# EAGLE design leiterplatte_kuechenlicht (EAGLE 6.4)
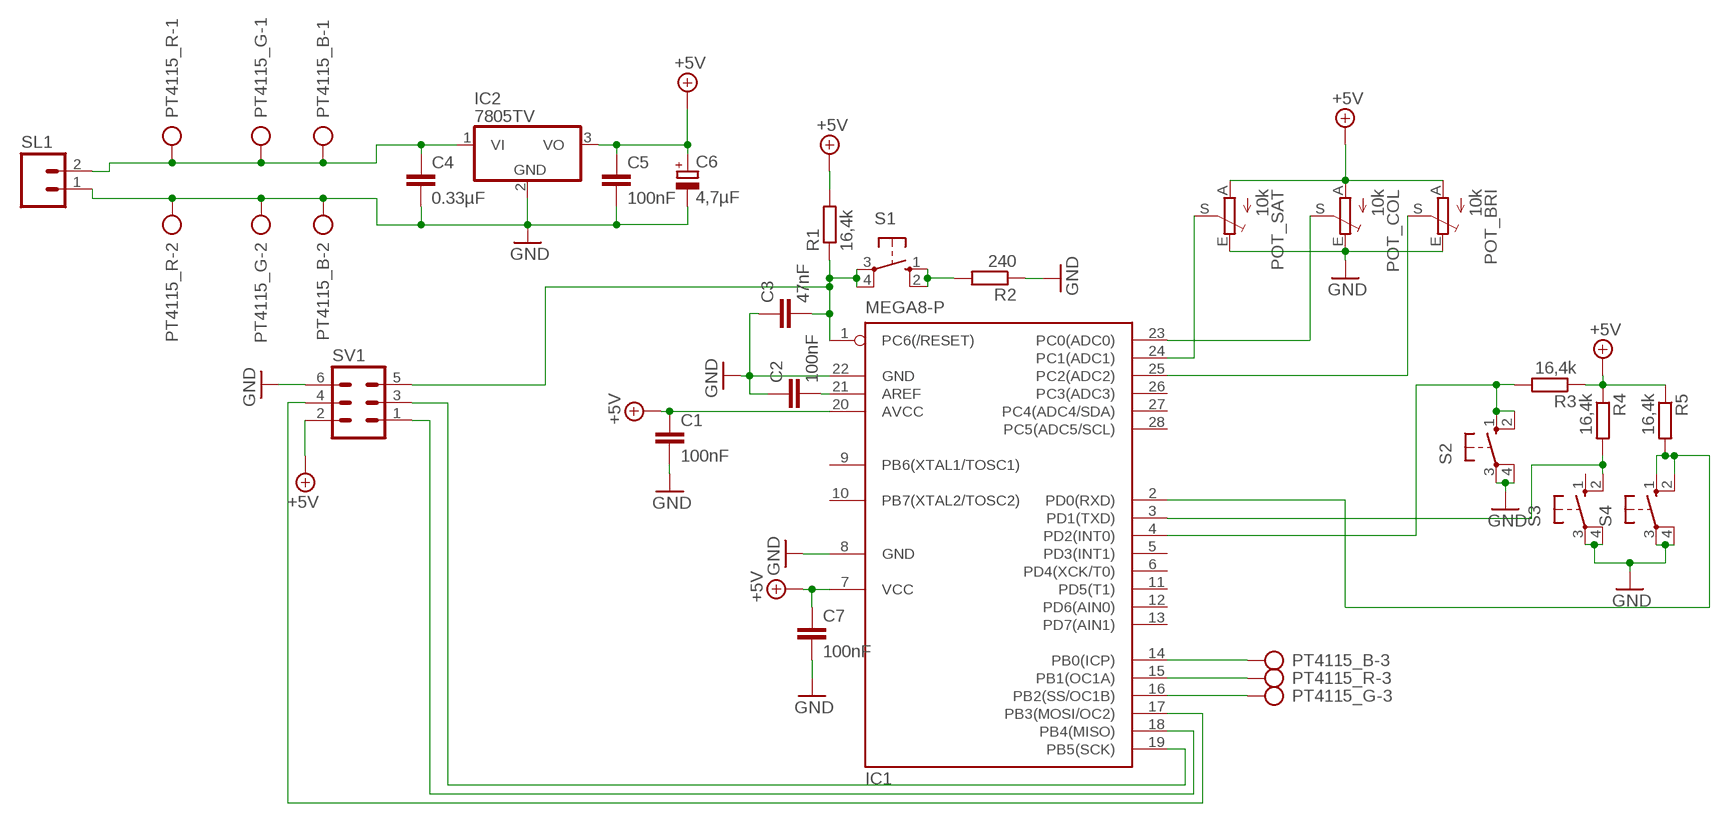
[diagram p0: schematic, sheet 1]

## Parts
C1  100nF  C2,5-3  [C2.5-3]
C2  100nF  C2,5-3  [C2.5-3]
C3  47nF  C-EU050-025X075  [C050-025X075]
C4  0.33µF  C2,5-3  [C2.5-3]
C5  100nF  C2,5-3  [C2.5-3]
C6  4,7µF  CPOL-EUE2,5-6E  [E2,5-6E]
C7  100nF  C2,5-3  [C2.5-3]
IC1  MEGA8-P  [DIL28-3]
IC2  7805TV  [TO220V]
POT_BRI  10k  TRIM_EU-CIP20C-6MM  [CIP20C-6MM]
POT_COL  10k  TRIM_EU-CIP20C-6MM  [CIP20C-6MM]
POT_SAT  10k  TRIM_EU-CIP20C-6MM  [CIP20C-6MM]
PT4115_B  AK300/3  [AK300/3]
PT4115_G  AK300/3  [AK300/3]
PT4115_R  AK300/3  [AK300/3]
R1  16,4k  R-EU_0204/7  [0204/7]
R2  240  R-EU_0204/7  [0204/7]
R3  16,4k  R-EU_0204/7  [0204/7]
R4  16,4k  R-EU_0204/7  [0204/7]
R5  16,4k  R-EU_0204/7  [0204/7]
S1  10-XX  [B3F-10XX]
S2  10-XX  [B3F-10XX]
S3  10-XX  [B3F-10XX]
S4  10-XX  [B3F-10XX]
SL1  M02  [02P]
SV1  ML6  [ML6]

## Nets
+5V: C1.1 C5.1 C6.+ C7.1 IC1.7(VCC) IC1.20(AVCC) IC2.3(VO) POT_BRI.A POT_COL.A POT_SAT.A R1.2 R3.1 R4.1 R5.1 SV1.2
GND: C1.2 C2.1 C3.1 C4.2 C5.2 C6.- C7.2 IC1.8(GND) IC1.22(GND) IC2.2(GND) POT_BRI.E POT_COL.E POT_SAT.E PT4115_B.2 PT4115_G.2 PT4115_R.2 R2.1 S2.3(P) S2.4(P1) S3.3(P) S3.4(P1) S4.3(P) S4.4(P1) SL1.1 SV1.6
N$1: R2.2 S1.1(S) S1.2(S1)
N$2: C4.1 IC2.1(VI) PT4115_B.1 PT4115_G.1 PT4115_R.1 SL1.2
N$3: C2.2 IC1.21(AREF)
N$4: IC1.24(PC1(ADC1)) POT_SAT.S
N$5: IC1.23(PC0(ADC0)) POT_COL.S
N$6: IC1.25(PC2(ADC2)) POT_BRI.S
N$7: IC1.15(PB1(OC1A)) PT4115_R.3
N$8: C3.2 IC1.1(PC6(/RESET)) R1.1 S1.3(P) S1.4(P1) SV1.5
N$9: IC1.19(PB5(SCK)) SV1.3
N$10: IC1.18(PB4(MISO)) SV1.1
N$11: IC1.17(PB3(MOSI/OC2)) SV1.4
N$12: IC1.16(PB2(SS/OC1B)) PT4115_G.3
N$13: IC1.14(PB0(ICP)) PT4115_B.3
N$14: IC1.2(PD0(RXD)) R5.2 S4.1(S) S4.2(S1)
N$15: IC1.3(PD1(TXD)) R4.2 S3.2(S1)
N$19: IC1.4(PD2(INT0)) R3.2 S2.1(S) S2.2(S1)
Unconnected: IC1.5(PD3(INT1)) IC1.6(PD4(XCK/T0)) IC1.9(PB6(XTAL1/TOSC1)) IC1.10(PB7(XTAL2/TOSC2)) IC1.11(PD5(T1)) IC1.12(PD6(AIN0)) IC1.13(PD7(AIN1)) IC1.26(PC3(ADC3)) IC1.27(PC4(ADC4/SDA)) IC1.28(PC5(ADC5/SCL)) S3.1(S)

## Library data of the parts
C1 C2 C4 C5 C7 = capacitor-wima:C: CAPACITOR naming: grid - package width
C3 = rcl:C-EU: CAPACITOR, European symbol
C6 = rcl:CPOL-EU: POLARIZED CAPACITOR, European symbol
IC1 = atmel:MEGA8-P: MICROCONTROLLER 8 Kbytes FLASH, 1 kbytes SRAM, 512 bytes EEPROM, USART, 4-channel 10 bit ADC, 2-channel 8 bit ADC Pin compatible with Atmega48, ATMega88, ATMega168 Source: avr.lbr; OC_FARNELL: unknown; OC_NEWARK: unknown
IC2 = linear:78*: Positive VOLTAGE REGULATOR Source: http://cache.national.com/ds/LM/LM78L05.pdf http://www.fairchildsemi.com/ds/LM/LM7805.pdf
POT_BRI POT_COL POT_SAT = pot:TRIM_EU-: POTENTIOMETER
PT4115_B PT4115_G PT4115_R = con-ptr500:AK300/3: CONNECTOR; OC_FARNELL: unknown; OC_NEWARK: unknown
R1-R5 = rcl:R-EU_: RESISTOR, European symbol
S1-S4 = switch-omron:10-XX: OMRON SWITCH; MPN: B3F-1000; OC_FARNELL: 176432; OC_NEWARK: 36M3542
SL1 = con-amp-quick:M02: AMP QUICK CONNECTOR; OC_FARNELL: unknown; OC_NEWARK: unknown
SV1 = con-ml:ML6: HARTING; OC_FARNELL: unknown; OC_NEWARK: unknown

## Board
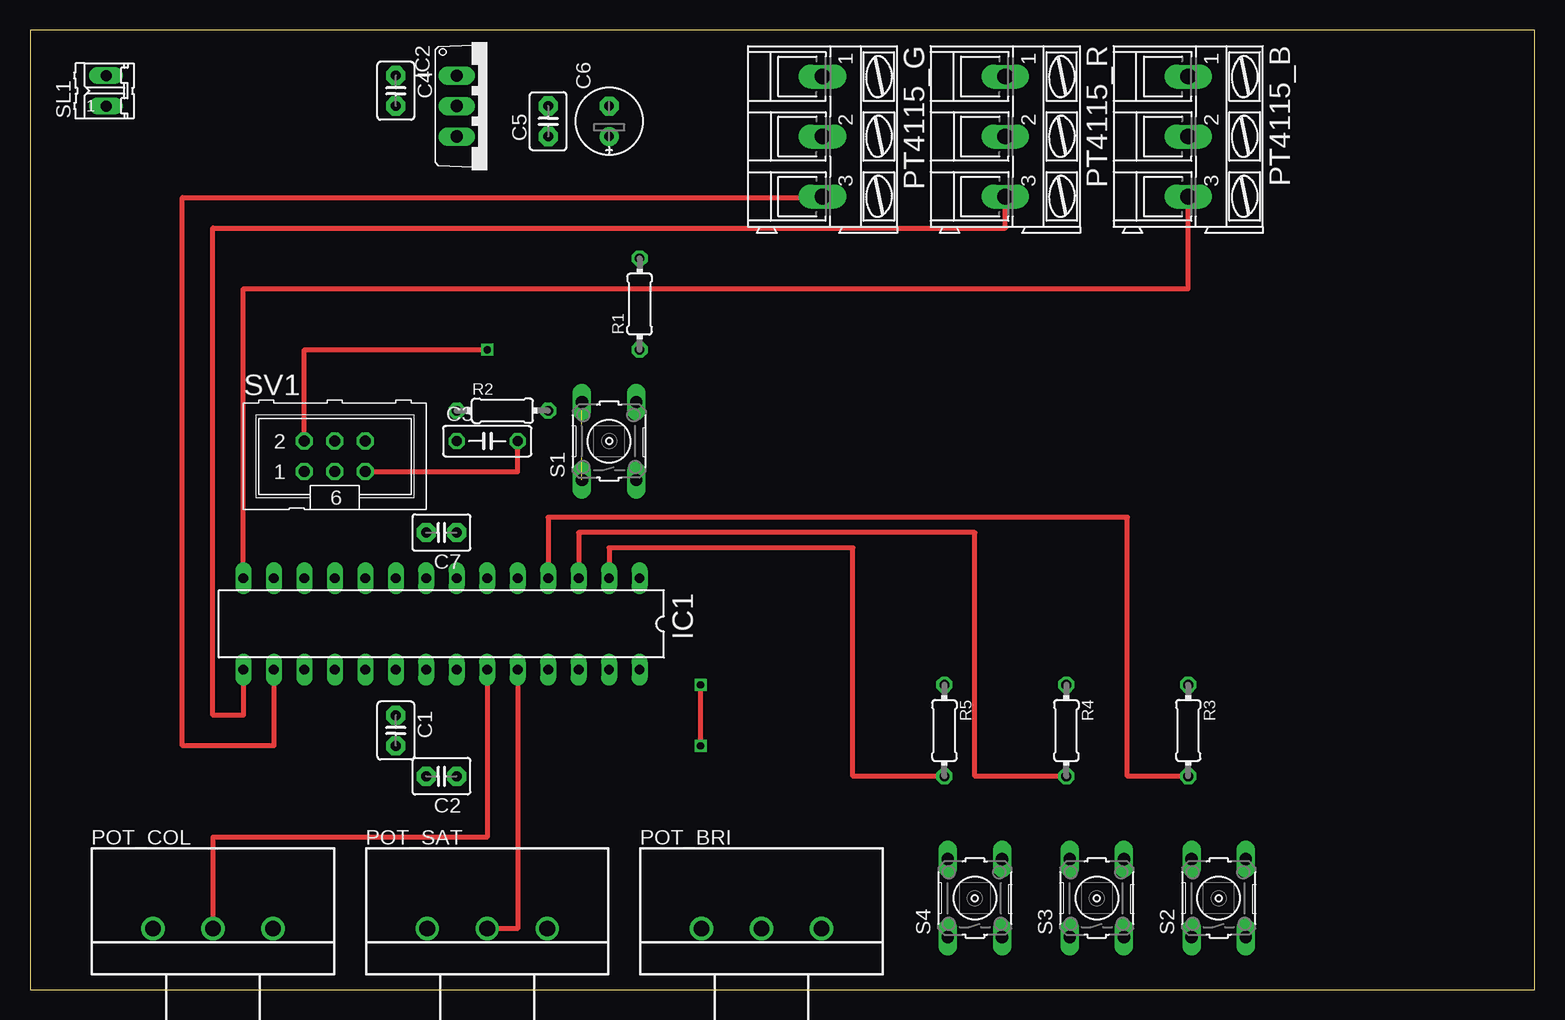
[diagram p1: board, top side]
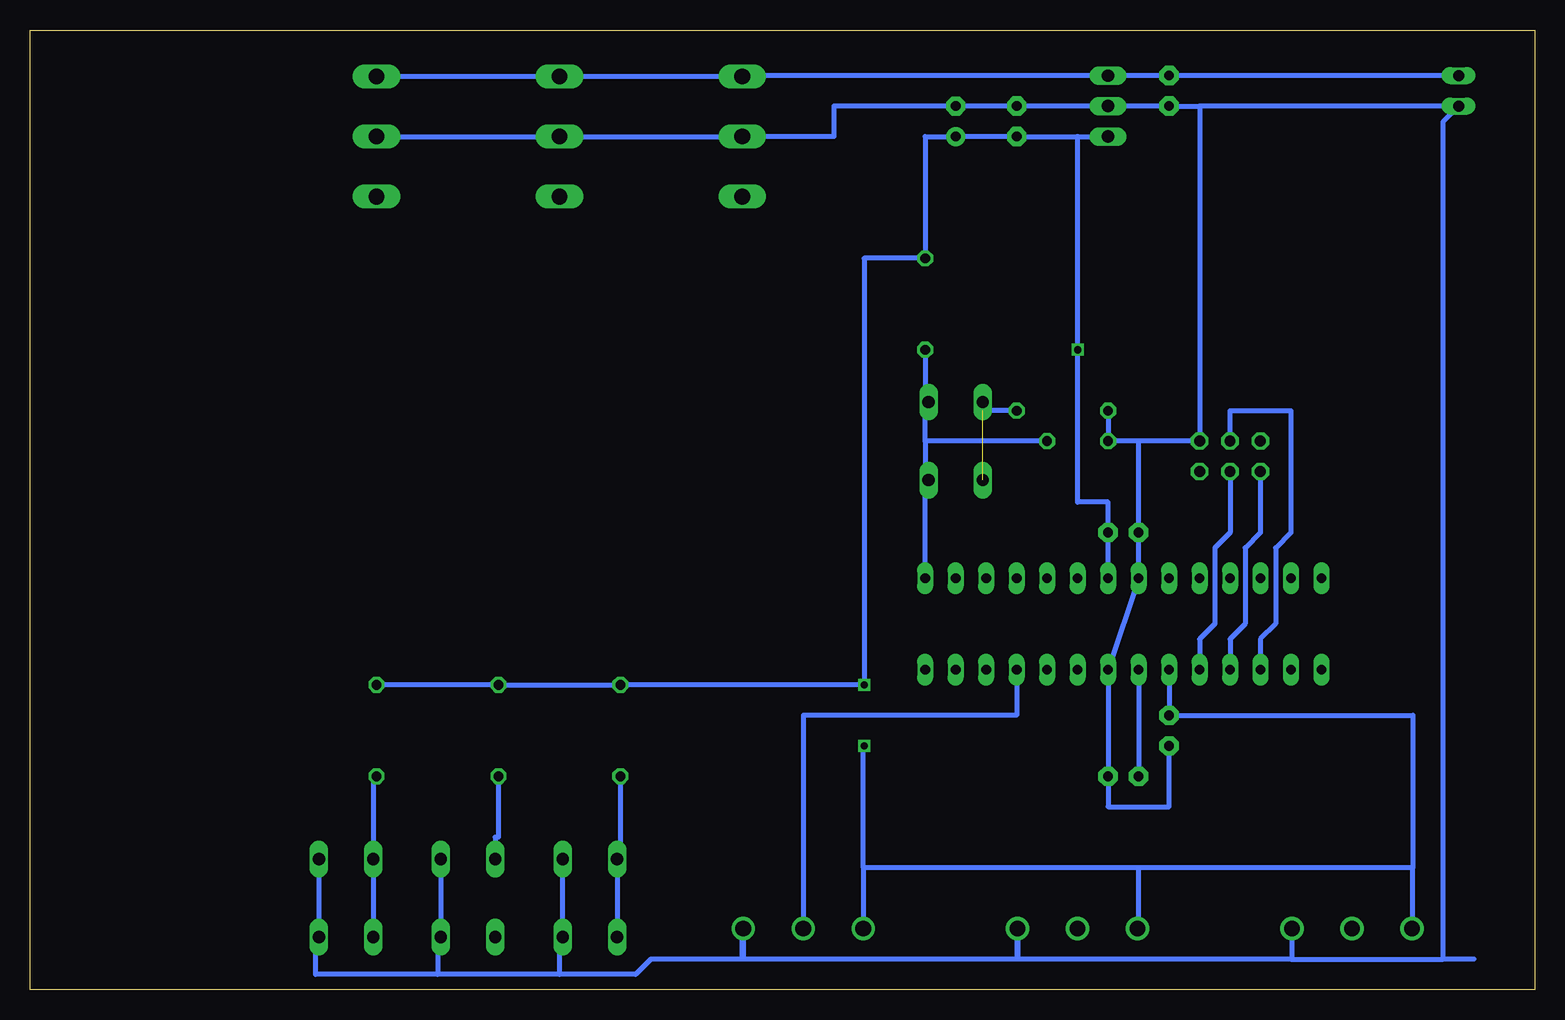
[diagram p2: board, bottom side, seen from below]

Size 125.4 x 80 mm. Coordinates in mm from the lower left corner, seen from the top.
Outline: 0,0 125.4,0 125.4,80 0,80 0,0
Copper layers (1*16): Top 0.035mm / dielectric 1.5mm / Bottom 0.035mm
Design rules "default": minimum track width 10mil, minimum drill 24mil, track to track 8mil, track to pad 8mil, pad to pad 8mil, via to via 8mil, smd to smd 8mil, copper to edge 40mil, drill to drill 8mil, minimum pad ring 10mil, minimum via ring 8mil, stop-mask expansion 4mil, vias tented up to drill 0mil, thermal gap 10mil

### Footprints (pad centres in the part's own frame; a part is rotated, then mirrored left to right if it is on the bottom)
C2.5-3 = drill 0.813 pad 1.6 octagon: 1 -1.27,0; 2 1.27,0
C050-025X075 = drill 0.813 octagon: 1 -2.54,0; 2 2.54,0
E2,5-6E = drill 0.813 pad 1.575: + -1.27,0 | drill 0.813 pad 1.575 octagon: - 1.27,0
DIL28-3 = drill 0.813 long: 1 -16.51,-3.81; 2 -13.97,-3.81; 3 -11.43,-3.81; 4 -8.89,-3.81; 5 -6.35,-3.81; 6 -3.81,-3.81; 7 -1.27,-3.81; 8 1.27,-3.81; 9 3.81,-3.81; 10 6.35,-3.81; 11 8.89,-3.81; 12 11.43,-3.81; 13 13.97,-3.81; 14 16.51,-3.81; 15 16.51,3.81; 16 13.97,3.81; 17 11.43,3.81; 18 8.89,3.81; 19 6.35,3.81; 20 3.81,3.81; 21 1.27,3.81; 22 -1.27,3.81; 23 -3.81,3.81; 24 -6.35,3.81; 25 -8.89,3.81; 26 -11.43,3.81; 27 -13.97,3.81; 28 -16.51,3.81
TO220V = drill 1.016 long: 1 -2.54,-2.54; 2 0,-2.54; 3 2.54,-2.54
CIP20C-6MM = drill 1.3 pad 1.93: A -5,0; E 5,0; S 0,0
AK300/3 = drill 1.321 long: 1 -5.004,0; 2 0,0; 3 5.004,0
0204/7 = drill 0.813 octagon: 1 -3.81,0; 2 3.81,0
B3F-10XX = drill 1.016 long: 1 -3.251,2.261; 2 3.251,2.261; 3 -3.251,-2.261; 4 3.251,-2.261
02P = drill 0.914 long: 1 -1.27,0; 2 1.27,0
ML6 = drill 0.914 octagon: 1 -2.54,-1.27; 2 -2.54,1.27; 3 0,-1.27; 4 0,1.27; 5 2.54,-1.27; 6 2.54,1.27

### Placement (x,y rotation side)
C1  30.48,21.59 270 top
C2  34.29,17.78 180 top
C3  38.1,45.72 0 top
C4  30.48,74.93 270 top
C5  43.18,72.39 90 top
C6  48.26,72.39 90 top
C7  34.29,38.1 180 top
IC1  34.29,30.48 180 top
IC2  38.1,73.66 270 top
POT_BRI  60.96,5.08 0 top
POT_COL  15.24,5.08 0 top
POT_SAT  38.1,5.08 0 top
PT4115_B  96.52,71.12 270 top
PT4115_G  66.04,71.12 270 top
PT4115_R  81.28,71.12 270 top
R1  50.8,57.15 90 top
R2  39.37,48.26 0 top
R3  96.52,21.59 270 top
R4  86.36,21.59 270 top
R5  76.2,21.59 270 top
S1  48.26,45.72 90 top
S2  99.06,7.62 90 top
S3  88.9,7.62 90 top
S4  78.74,7.62 90 top
SL1  6.35,74.93 90 top
SV1  25.4,44.45 0 top

### Tracks (layer width: path | path; a pad name or v marks a point on that pad's centre or on a via)
+5V  (via drill 0.6)
  Top 0.406: SV1.2 22.86,53.34 v38.1,53.34 | v55.88,20.32 v55.88,25.4
  Bottom 0.406: R3.1 R4.1 R5.1 v55.88,25.4 55.88,60.96 R1.2 50.8,71.12 C6.+ C5.1 38.1,71.12 | POT_SAT.A 33.02,5.08 33.02,10.16 | 55.96,10.16 POT_BRI.A | 33.02,10.16 55.96,10.16 | POT_COL.A 10.16,5.08 10.16,10.16 | 10.16,10.16 33.02,10.16 | IC1.20 C1.1 10.16,22.86 10.16,10.16 | 38.1,71.12 IC2.3 | 55.96,10.16 55.96,20.24 v55.88,20.32 | IC1.7 C7.1 35.56,40.64 38.1,40.64 v38.1,53.34 38.1,71.12
GND
  Bottom 0.406: 27.94,73.66 SL1.1 7.62,72.39 7.62,2.54 | R2.1 C3.1 33.02,45.72 | PT4115_B.2 PT4115_R.2 PT4115_G.2 58.42,71.12 58.42,73.66 C6.- C5.2 IC2.2 C4.2 27.94,73.66 | C1.2 30.48,15.24 35.56,15.24 C2.1 IC1.22 IC1.8 C7.2 33.02,45.72 | S3.4 S3.3 91.44,4.09 91.44,1.27 | S2.4 S2.3 101.6,4.09 101.6,1.27 91.44,1.27 | S4.4 S4.3 81.28,4.09 81.28,1.27 | 33.02,45.72 SV1.6 27.94,73.66 | POT_COL.E 20.24,2.62 20.32,2.54 | 20.32,2.54 43.18,2.54 | 43.18,2.54 43.18,5 POT_SAT.E 43.1,2.62 43.18,2.54 | 43.18,2.54 66.04,2.54 | 66.04,2.54 66.04,5 POT_BRI.E 65.96,2.62 66.04,2.54 | 66.04,2.54 73.66,2.54 74.93,1.27 81.28,1.27 | 81.28,1.27 91.44,1.27 | 20.32,2.54 7.62,2.54 | 5.08,2.54 7.62,2.54
N$1  (1 unrouted)
  Bottom 0.406: R2.2 46,48.26 S1.2
N$2
  Bottom 0.406: PT4115_R.1 81.28,76.2 | SL1.2 C4.1 IC2.1 66.04,76.2 PT4115_G.1 PT4115_R.1 | PT4115_R.1 PT4115_B.1
N$3
  Bottom 0.406: IC1.21 C2.2
N$4
  Top 0.406: IC1.24 40.64,5.08 POT_SAT.S
N$5
  Top 0.406: IC1.23 38.1,12.7 15.24,12.7 POT_COL.S
N$6
  Bottom 0.406: IC1.25 43.18,22.86 60.96,22.86 POT_BRI.S
N$7
  Top 0.406: IC1.15 17.78,22.86 15.24,22.86 15.24,63.5 81.28,63.5 PT4115_R.3
N$8
  Top 0.406: SV1.5 40.64,43.18 C3.2
  Bottom 0.406: R1.1 50.8,48.26 | 50.8,48.26 50.52,48.26 S1.4 | IC1.1 50.8,43.18 | 50.8,43.18 50.52,43.18 S1.3 | C3.2 50.8,45.72 | 50.8,45.72 50.8,43.18 | 50.8,45.72 50.8,48.26
N$9
  Bottom 0.406: SV1.3 25.4,38.1 26.67,36.83 26.67,30.48 27.94,29.21 IC1.19
N$10
  Bottom 0.406: SV1.1 22.86,38.1 24.13,36.83 24.13,30.48 25.4,29.21 IC1.18
N$11
  Bottom 0.406: SV1.4 25.4,48.26 20.32,48.26 20.32,38.1 21.59,36.83 21.59,30.48 22.86,29.21 IC1.17
N$12
  Top 0.406: IC1.16 20.32,20.32 12.7,20.32 12.7,66.04 66.04,66.04 PT4115_G.3
N$13
  Top 0.406: IC1.14 17.78,58.42 96.52,58.42 PT4115_B.3
N$14
  Top 0.406: R5.2 68.58,17.78 68.58,36.83 48.26,36.83 IC1.2
  Bottom 0.406: R5.2 76.2,10.16 76.48,10.16 | 76.48,10.16 S4.2 | 76.48,10.16 S4.1
N$15
  Top 0.406: R4.2 78.74,17.78 78.74,38.1 45.72,38.1 IC1.3
  Bottom 0.406: R4.2 86.36,12.7 86.64,12.7 S3.2
N$19
  Top 0.406: R3.2 91.44,17.78 91.44,39.37 43.18,39.37 IC1.4
  Bottom 0.406: R3.2 96.8,17.78 S2.2 S2.1